# EAGLE design attiny (EAGLE 9.6.2)
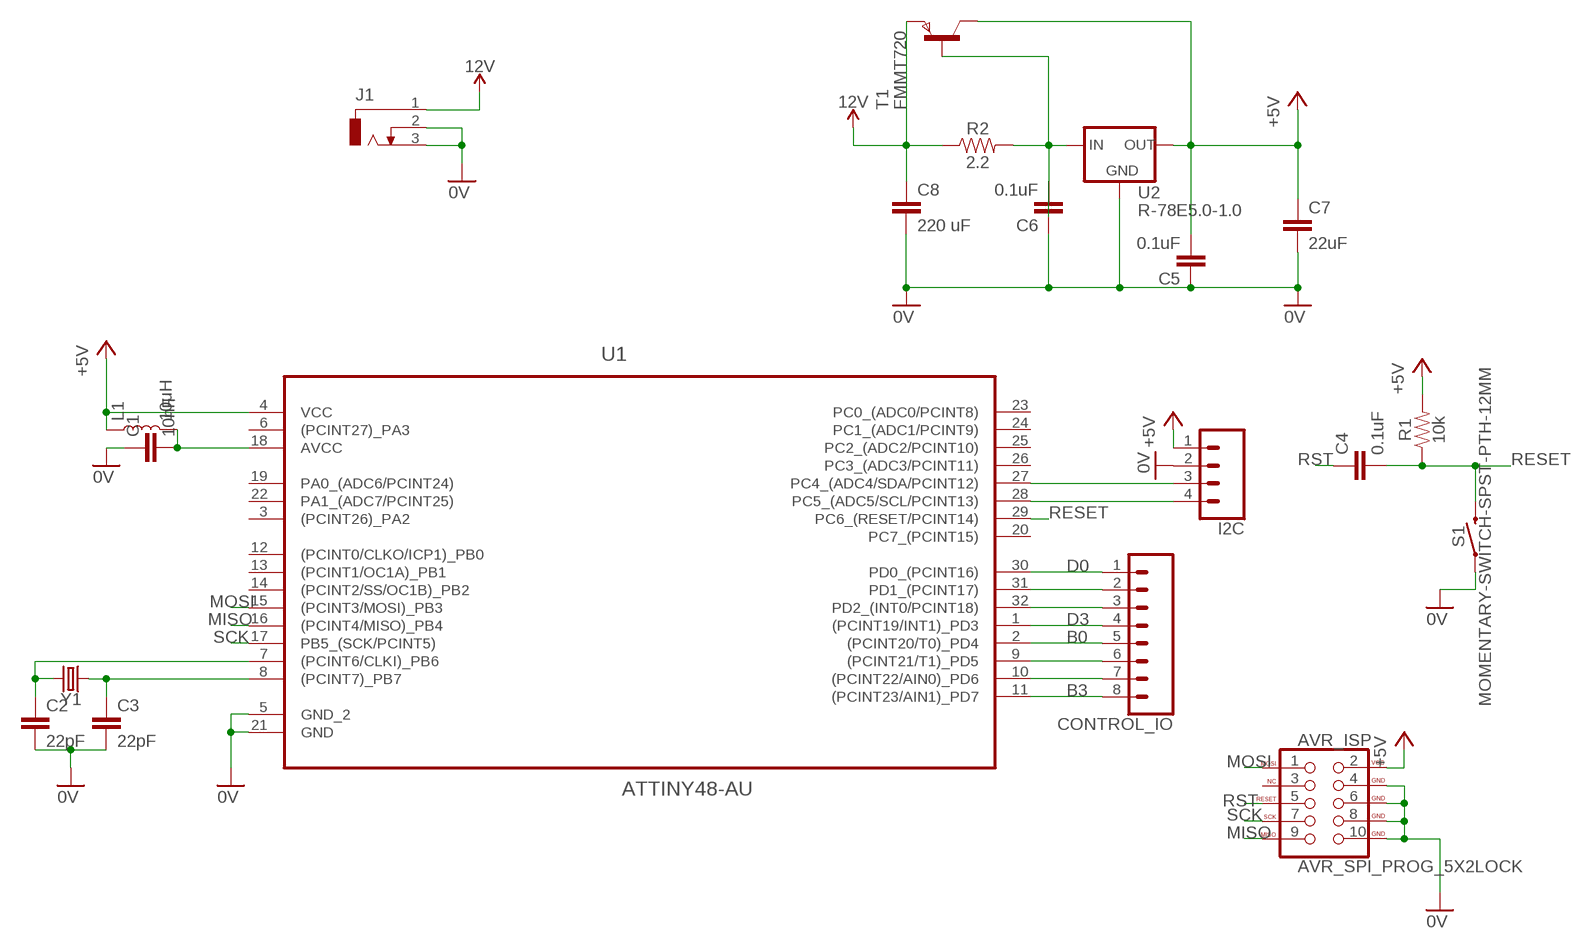
[diagram p0: schematic, sheet 1]

## Parts
AVR_ISP  AVR_SPI_PROG_5X2LOCK  [2X5-SHROUDED_LOCK]
C1  10nF  10NF-PTH-10MM-10000V-1-%  [CAP-PTH-10MM]
C2  22pF  22PF-0603-50V-5%  [0603]
C3  22pF  22PF-0603-50V-5%  [0603]
C4  0.1uF  0.1UF-KIT-EZ-50V-20%  [CAP-PTH-SMALL-KIT]
C5  0.1uF  0.1UF-KIT-EZ-50V-20%  [CAP-PTH-SMALL-KIT]
C6  0.1uF  0.1UF-KIT-EZ-50V-20%  [CAP-PTH-SMALL-KIT]
C7  22uF  22UF-0805-6.3V-20%  [0805]
C8  220 uF  C7.5/5  [C7.5B5]
CONTROL_IO  CONN_08"  [1X08]
I2C  CONN_04PTH  [1X04]
J1  DCJ0303  [DCJ0303]
L1  10μH  10μH_SHIELDED_INDUCTOR0805  [0805]
R1  10k  10KOHM-HORIZ-1/6W-5%  [AXIAL-0.3]
R2  2.2  2.2OHM-0603-1/10W-5%  [0603]
S1  MOMENTARY-SWITCH-SPST-PTH-12MM  [TACTILE_SWITCH_PTH_12MM]
T1  FMMT720  [SOT-23]
U1  ATTINY48-AU  [QFP80P900X900X120-32N]
U2  R-78E5.0-1.0  [DC-DC_CONVERTER_78XX]
Y1  CRYSTALPTH-2X6  [CRYSTAL-PTH-2X6-CYL]

## Nets
0V: AVR_ISP.4(GND) AVR_ISP.6(GND) AVR_ISP.8(GND) AVR_ISP.10(GND) C1.1 C2.2 C3.2 C5.1 C6.1 C7.2 C8.2 I2C.2 J1.2 J1.3 S1.1 U1.5(GND_2) U1.21(GND) U2.GND
12V: C8.1 J1.1 R2.1 T1.2(E)
+5V: AVR_ISP.2(VCC) C5.2 C7.1 I2C.1 L1.1 R1.P$2 T1.1(C) U1.4(VCC) U2.VOUT(OUT)
B0: CONTROL_IO.5 U1.2((PCINT20/T0)_PD4)
B3: CONTROL_IO.8 U1.11((PCINT23/AIN1)_PD7)
D0: CONTROL_IO.1 U1.30(PD0_(PCINT16))
D3: CONTROL_IO.4 U1.1((PCINT19/INT1)_PD3)
MISO: AVR_ISP.9(MISO) U1.16((PCINT4/MISO)_PB4)
MOSI: AVR_ISP.1(MOSI) U1.15((PCINT3/MOSI)_PB3)
N$1: C1.2 L1.2 U1.18(AVCC)
N$2: I2C.3 U1.27(PC4_(ADC4/SDA/PCINT12))
N$3: I2C.4 U1.28(PC5_(ADC5/SCL/PCINT13))
N$4: C2.1 U1.7((PCINT6/CLKI)_PB6) Y1.2
N$5: C3.1 U1.8((PCINT7)_PB7) Y1.1
N$6: C6.2 R2.2 T1.3(B) U2.VIN(IN)
N$7: CONTROL_IO.2 U1.31(PD1_(PCINT17))
N$8: CONTROL_IO.3 U1.32(PD2_(INT0/PCINT18))
N$11: CONTROL_IO.6 U1.9((PCINT21/T1)_PD5)
N$12: CONTROL_IO.7 U1.10((PCINT22/AIN0)_PD6)
RESET: C4.2 R1.P$1 S1.3 U1.29(PC6_(RESET/PCINT14))
RST: AVR_ISP.5(RESET) C4.1
SCK: AVR_ISP.7(SCK) U1.17(PB5_(SCK/PCINT5))
Unconnected: AVR_ISP.3(NC) U1.3((PCINT26)_PA2) U1.6((PCINT27)_PA3) U1.12((PCINT0/CLKO/ICP1)_PB0) U1.13((PCINT1/OC1A)_PB1) U1.14((PCINT2/SS/OC1B)_PB2) U1.19(PA0_(ADC6/PCINT24)) U1.20(PC7_(PCINT15)) U1.22(PA1_(ADC7/PCINT25)) U1.23(PC0_(ADC0/PCINT8)) U1.24(PC1_(ADC1/PCINT9)) U1.25(PC2_(ADC2/PCINT10)) U1.26(PC3_(ADC3/PCINT11))

## Library data of the parts
AVR_ISP = SparkFun-Connectors:AVR_SPI_PROG_5X2: AVR 10-pin ICSP Header This is the standard AVR In Circuit Serial Programming header. Minimal, but includes pin one indicator. Works with standard Olimex programmers. SparkFun Products: 2x5 AVR ICSP Male Header <https://www.sparkfun.com/products/778> - PTH 2x5 Pin Shrouded Header <https://www.sparkfun.com/products/8506> - PTH2; PROD_ID: CONN-08671; SF_ID: PRT-08506
C1 = SparkFun-Capacitors:10NF: 0.01uF/10nF/10,000pF ceramic capacitors A capacitor is a passive two-terminal electrical component used to store electrical energy temporarily in an electric field. CAP-09321; PROD_ID: CAP-09321
C2 C3 = SparkFun-Capacitors:22PF: 22pF ceramic capacitors A capacitor is a passive two-terminal electrical component used to store electrical energy temporarily in an electric field.; PROD_ID: CAP-07876
C4-C6 = SparkFun-Capacitors:0.1UF: 0.1µF ceramic capacitors A capacitor is a passive two-terminal electrical component used to store electrical energy temporarily in an electric field.; PROD_ID: CAP-08370
C7 = SparkFun-Capacitors:22UF: 22µF ceramic capacitors A capacitor is a passive two-terminal electrical component used to store electrical energy temporarily in an electric field.; PROD_ID: CAP-08402
C8 = capacitor-wima:C: CAPACITOR naming: grid - package width
CONTROL_IO = SparkFun-Connectors:CONN_08: Multi connection point. Often used as Generic Header-pin footprint for 0.1 inch spaced/style header connections On any of the 0.1 inch spaced packages, you can populate with these: Break Away Headers - Straight <https://www.sparkfun.com/products/116> (PRT-00116) Break Away Male Headers - Right Angle <https://www.sparkfun.com/products/553> (PRT-00553) Female Headers <https://www.sparkfun.com/products/115> (PRT-00115) Break Away Headers - Machine Pin <https://www.sparkfun.com/products/117> (PRT-00117) Break Away Female Headers - Swiss Machine Pin <https://www.sparkfun.com/products/743> (PRT-00743) Arduino Stackable Header - 8 Pin <https://www.sparkfun.com/products/9279> (PRT-09279) For SCREWTERMINALS and SPRING TERMINALS visit here: Screw Terimnals on SparkFun.com <https://www.sparkfun.com/search/results?term=Screw+Terminals> (5mm/3.5mm/2.54mm spacing) This device is also useful as a general connection point to wire up your design to another part of your project. Our various solder wires solder well into these plated through hole pads. Hook-Up Wire - Assortment (Stranded, 22 AWG) <https://www.sparkfun.com/products/11375> (PRT-11375) Hook-Up Wire - Assortment (Solid Core, 22 AWG) <https://www.sparkfun.com/products/11367> (PRT-11367) View the entire wire category on our website here <https://www.sparkfun.com/categories/141> Special notes: Molex polarized connector foot print use with SKU : PRT-08231 with associated crimp pins and housings. 1MM SMD Version SKU: PRT-10208 NOTES ON THE VARIANTS LOCK and LOCK_LONGPADS... This footprint was designed to help hold the alignment of a through-hole component (i.e. 6-pin header) while soldering it into place. You may notice that each hole has been shifted either up or down by 0.005 of an inch from it's more standard position (which is a perfectly straight line). This slight alteration caused the pins (the squares in the middle) to touch the edges of the holes. Because they are alternating, it causes a "brace" to hold the component in place. 0.005 has proven to be the perfect amount of "off-center" position when using our standard breakaway headers. Although looks a little odd when you look at the bare footprint, once you have a header in there, the alteration is very hard to notice. Also,if you push a header all the way into place, it is covered up entirely on the bottom side.; PROD_ID: CONN-08438
I2C = SparkFun-Connectors:CONN_04: Multi connection point. Often used as Generic Header-pin footprint for 0.1 inch spaced/style header connections On any of the 0.1 inch spaced packages, you can populate with these: Break Away Headers - Straight <https://www.sparkfun.com/products/116> (PRT-00116) Break Away Male Headers - Right Angle <https://www.sparkfun.com/products/553> (PRT-00553) Female Headers <https://www.sparkfun.com/products/115> (PRT-00115) Break Away Headers - Machine Pin <https://www.sparkfun.com/products/117> (PRT-00117) Break Away Female Headers - Swiss Machine Pin <https://www.sparkfun.com/products/743> (PRT-00743) For SCREWTERMINALS and SPRING TERMINALS visit here: Screw Terimnals on SparkFun.com <https://www.sparkfun.com/search/results?term=Screw+Terminals> (5mm/3.5mm/2.54mm spacing) This device is also useful as a general connection point to wire up your design to another part of your project. Our various solder wires solder well into these plated through hole pads. Hook-Up Wire - Assortment (Stranded, 22 AWG) <https://www.sparkfun.com/products/11375> (PRT-11375) Hook-Up Wire - Assortment (Solid Core, 22 AWG) <https://www.sparkfun.com/products/11367> (PRT-11367) View the entire wire category on our website here <https://www.sparkfun.com/categories/141> Special notes: Molex polarized connector foot print use with SKU : PRT-08231 with associated crimp pins and housings. 1MM SMD Version SKU: PRT-10208; PROD_ID: CONN-09696
J1 = con-jack:DCJ0303: DC POWER JACK Source: DCJ0303.pdf; OC_FARNELL: unknown; OC_NEWARK: unknown
L1 = SparkFun-Coils:10μH_SHIELDED_INDUCTOR: Murata 10uH Inductor 10uH 60mA 400mOhm 0805 Package Shielded; PROD_ID: NDUC-13231
R1 = SparkFun-Resistors:10KOHM: 10kΩ resistor A resistor is a passive two-terminal electrical component that implements electrical resistance as a circuit element. Resistors act to reduce current flow, and, at the same time, act to lower voltage levels within circuits. - Wikipedia; PROD_ID: RES-08375
R2 = SparkFun-Resistors:2.2OHM: 2.2Ω resistor A resistor is a passive two-terminal electrical component that implements electrical resistance as a circuit element. Resistors act to reduce current flow, and, at the same time, act to lower voltage levels within circuits. - Wikipedia; PROD_ID: RES-07823
S1 = SparkFun-Switches:MOMENTARY-SWITCH-SPST: Momentary Switch (Pushbutton) - SPST Normally-open (NO) SPST momentary switches (buttons, pushbuttons). Variants PTH-12MM - 12mm square, through-hole Momentary Pushbutton Switch - 12mm Square <https://www.sparkfun.com/products/9190> (COM-09190) PTH-6.0MM, PTH-6.0MM-KIT - 6.0mm square, through-hole Mini Pushbutton Switch <https://www.sparkfun.com/products/97> (COM-00097) KIT package intended for soldering kit's - only one side of pads' copper is exposed. PTH-RIGHT-ANGLE-KIT - Right-angle, through-hole Right Angle Tactile Button <https://www.sparkfun.com/products/10791> - Used on SparkFun BigTime Watch Kit <https://www.sparkfun.com/products/11734> SMD-12MM - 12mm square, surface-mount Tactile Button - SMD (12mm) <https://www.sparkfun.com/products/12993> (COM-12993) Used on SparkFun PicoBoard <https://www.sparkfun.com/products/11888> SMD-4.5MM - 4.5mm Square Trackball Switch Used on SparkFun Blackberry Trackballer Breakout <https://www.sparkfun.com/products/13169> SMD-4.6MMX2.8MM - 4.60mm x 2.80mm, surface mount Used on SparkFun Pro Micro - RP2040 <https://www.sparkfun.com/products/17717> SMD-5.2MM, SMD-5.2-REDUNDANT - 5.2mm square, surface-mount Mini Pushbutton Switch - SMD <https://www.sparkfun.com/products/8720> (COM-08720) Used on Arduino Pro Mini <https://www.sparkfun.com/products/11114> REDUNDANT package connects both switch circuits together SMD-6.0X3.5MM - 6.0 x 3.5mm, surface mount Momentary Reset Switch SMD <https://www.sparkfun.com/products/8229> (COM-08229) SMD-6.2MM-TALL - 6.2mm square, surface mount Tactile Button - SMD (6mm) <https://www.sparkfun.com/products/12992> Used on SparkFun Digital Sandbox <https://www.sparkfun.com/products/12651> SMD-RIGHT-ANGLE - Right-angle, surface mount Used on SparkFun Block for Intel® Edison - Arduino <https://www.sparkfun.com/products/13036>; PROD_ID: SWCH-09185; SF_SKU: COM-09190
T1 = zetex:FMMT7*: PNP SILICON POWER (SWITCHING) TRANSISTORS SuperSOT Source: http://www.zetex.com/3.0/pdf/FMMT717.pdf; MPN: FMMT720; OC_FARNELL: 9526471; OC_NEWARK: 96K9969
U1 = ATTINY48-AU:ATTINY48-AU: 8-bit Microcontroller Check prices <https://pricing.snapeda.com/parts/ATTINY48-AU/Microchip/view-part?ref=eda>; AVAILABILITY: In Stock; DESCRIPTION: Clock speed: 12 MHz; Connectivity: I²C, SPI; Core size: 8-Bit; Data converter (embedded microcontroller): A/D 8x10b; EEPROM size (embedded microcontroller): 64 x 8; Enclosure type (semiconductors): TQFP 32 (7x7); I/O number: 28; Manufacturer: Microchip Technology; Manufacturer code (components): MCP; Operating temperature (max.) (num): +85 °C; Operating temperature (min.) (num): -40 °C; Oscillator type (embedded microcontroller): Internal; Peripherals: Brown-out Detect/Reset, POR, WDT; Processor core: AVR; Program memory size (embedded microcontroller): 4 KB (2 K x 16); Program memory type (embedded microcontroller): FLASH; RAM size (microcontroller): 256 x 8; Series (embedded microcontrollers): AVR® ATtiny; Supply voltage (max.): 5.5 V; Supply voltage (min.): 1.8 V; Type (manufacturer type): ATTINY48-AU; Type of embedded system (category): Embedded microcontroller; MF: Microchip; MP: ATTINY48-AU; PACKAGE: TQFP-32 Microchip; PRICE: None; PURCHASE-URL: https://pricing.snapeda.com/search/part/ATTINY48-AU/?ref=eda
U2 = SparkFun-IC-Power:R-78E5.0-1.0: Recom Power 5V 1A DC/DC Converter The Recom R-78E5.0-X.X is a compact DC/DC converter module that is a pin for pin drop-in replacement for the LM7805 linear voltage regulator. Specifications: Input Range: 7-28V Output Voltage: 5V Output Current: 1A Max Efficiency: 91% Datasheet <https://www.recom-power.com/pdf/Innoline/R-78Exx-1.0.pdf>; PROD_ID: COM-13655
Y1 = SparkFun-Clocks:CRYSTAL: Crystals (Generic) These are passive quartz crystals, which can be used as a clock source for a microcontroller. Crystal's are two-terminal devices. They require external "load" capacitors to generate an oscillating signal.

## Board
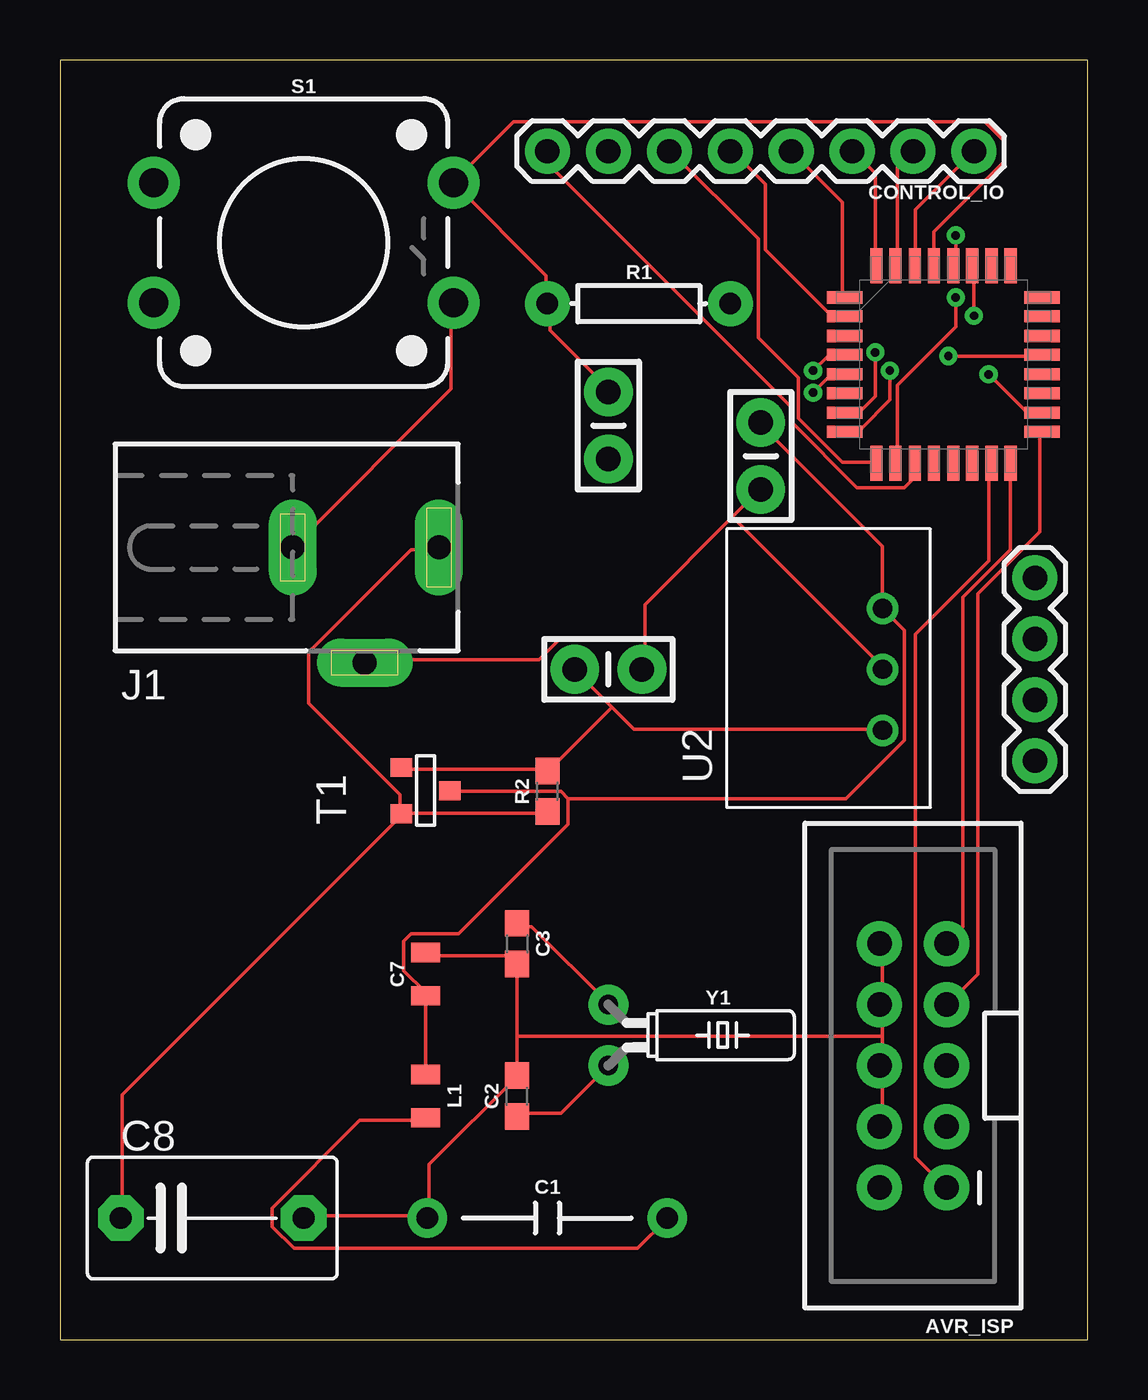
[diagram p1: board, top side]
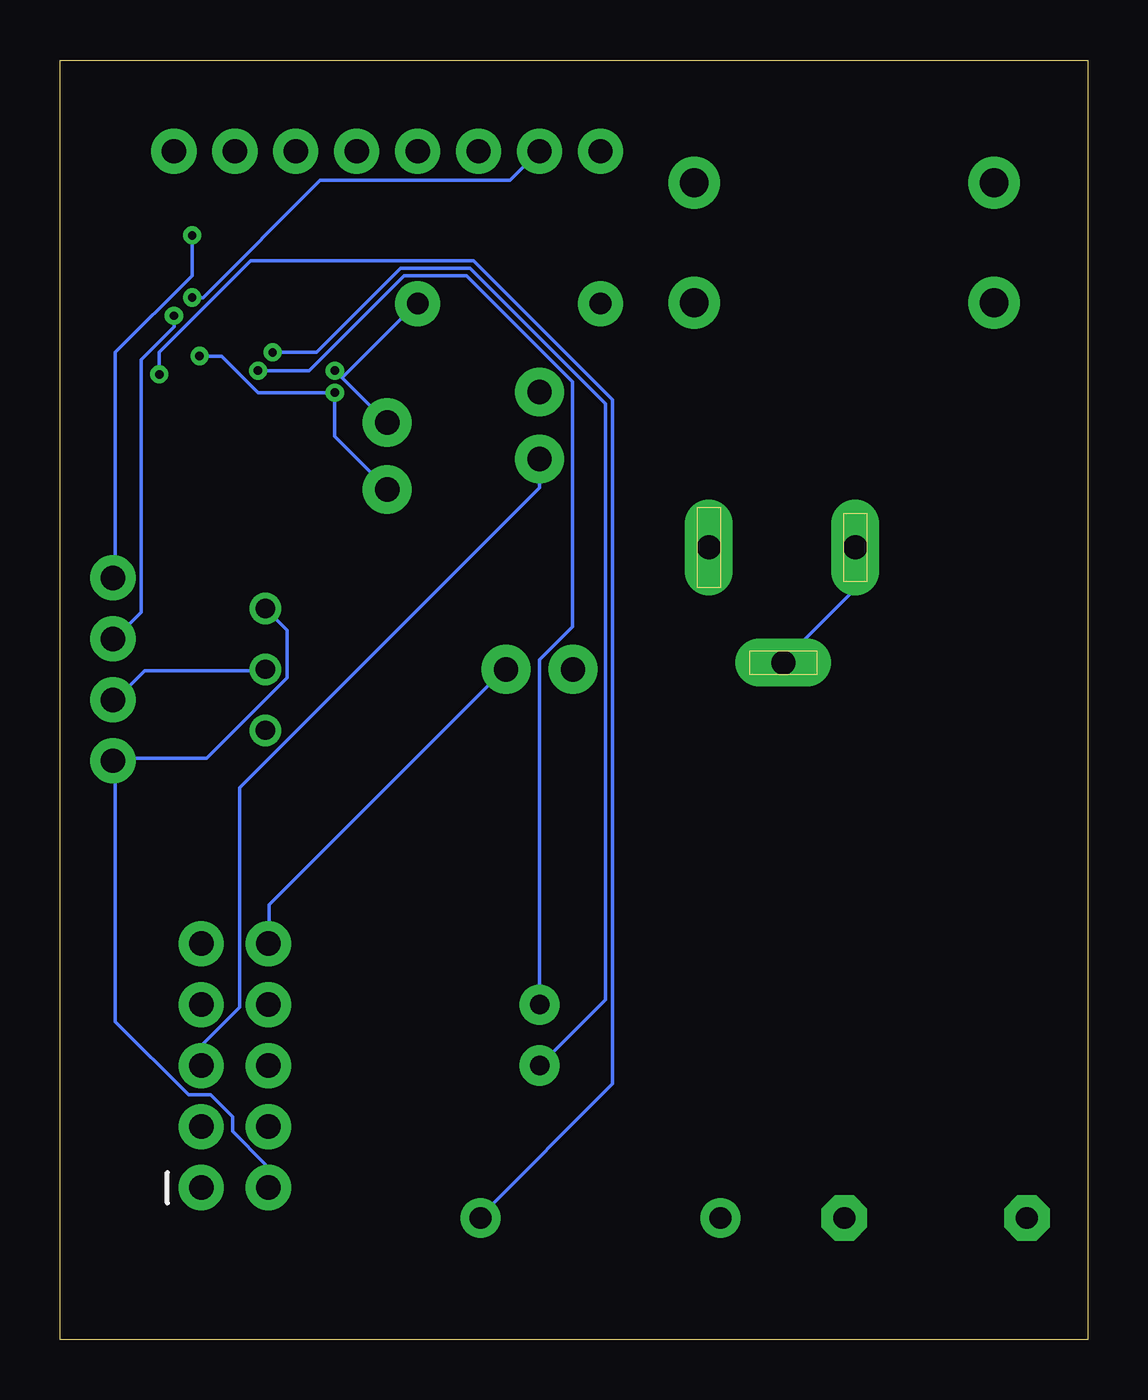
[diagram p2: board, bottom side, seen from below]

Size 42.85 x 53.33 mm. Coordinates in mm from the lower left corner, seen from the top.
Outline: 0,0 42.85,0 42.85,53.33 0,53.33 0,0
Copper layers (1*16): Top 0.035mm / dielectric 1.5mm / Bottom 0.035mm
Design rules "default": minimum track width 6mil, minimum drill 0.35mm, track to track 6mil, track to pad 6mil, pad to pad 6mil, via to via 6mil, smd to smd 6mil, copper to edge 40mil, drill to drill 6mil, minimum pad ring 10mil, minimum via ring 8mil, stop-mask expansion 4mil, vias tented up to drill 0mil, thermal gap 10mil

### Footprints (pad centres in the part's own frame; a part is rotated, then mirrored left to right if it is on the bottom)
2X5-SHROUDED_LOCK = drill 1.016 pad 1.88: 1 -1.397,5.08; 2 1.397,5.08; 3 -1.397,2.54; 4 1.397,2.54; 5 -1.397,0; 6 1.397,0; 7 -1.397,-2.54; 8 1.397,-2.54; 9 -1.397,-5.08; 10 1.397,-5.08
CAP-PTH-10MM = drill 0.9 pad 1.651: 1 -5,0; 2 5,0
0603 = smd 1.1 x 1: 1 -0.85,0; 2 0.85,0
CAP-PTH-SMALL-KIT = drill 1.016 pad 2.032: 1 -1.397,0; 2 1.397,0
0805 = smd 0.8 x 1.2: 1 -0.9,0; 2 0.9,0
C7.5B5 = drill 0.914 pad 1.905 octagon: 1 -3.81,0; 2 3.81,0
1X08 = drill 1.016 pad 1.88: 1 0,0; 2 2.54,0; 3 5.08,0; 4 7.62,0; 5 10.16,0; 6 12.7,0; 7 15.24,0; 8 17.78,0
1X04 = drill 1.016 pad 1.88: 1 0,0; 2 2.54,0; 3 5.08,0; 4 7.62,0
DCJ0303 = drill 1 pad 2 long: 1 0,3.1; 2 4.8,0; 3 0,-3
AXIAL-0.3 = drill 0.9 pad 1.88: P$1 -3.81,0; P$2 3.81,0
TACTILE_SWITCH_PTH_12MM = drill 1.2 pad 2.159: 1 6.25,-2.5; 2 -6.25,-2.5; 3 6.25,2.5; 4 -6.25,2.5
SOT-23 = smd 0.787 x 0.889: 1 0.025,-1.016; 2 -0.94,1.016; 3 0.991,1.016
QFP80P900X900X120-32N = smd 1.473 x 0.508: 1 -4.115,2.794; 2 -4.115,2.007; 3 -4.115,1.194; 4 -4.115,0.406; 5 -4.115,-0.406; 6 -4.115,-1.194; 7 -4.115,-2.007; 8 -4.115,-2.794; 17 4.115,-2.794; 18 4.115,-2.007; 19 4.115,-1.194; 20 4.115,-0.406; 21 4.115,0.406; 22 4.115,1.194; 23 4.115,2.007; 24 4.115,2.794 | smd 0.508 x 1.473: 9 -2.794,-4.115; 10 -2.007,-4.115; 11 -1.194,-4.115; 12 -0.406,-4.115; 13 0.406,-4.115; 14 1.194,-4.115; 15 2.007,-4.115; 16 2.794,-4.115; 25 2.794,4.115; 26 2.007,4.115; 27 1.194,4.115; 28 0.406,4.115; 29 -0.406,4.115; 30 -1.194,4.115; 31 -2.007,4.115; 32 -2.794,4.115
DC-DC_CONVERTER_78XX = drill 0.8: GND 0,0; VIN -2.54,0; VOUT 2.54,0
CRYSTAL-PTH-2X6-CYL = drill 0.813 pad 1.676: 1 -1.27,0; 2 1.27,0

### Placement (x,y rotation side)
AVR_ISP  35.56,11.43 180 top
C1  20.32,5.08 0 top
C2  19.05,10.16 90 top
C3  19.05,16.51 270 top
C4  22.86,38.1 90 top
C5  29.21,36.83 90 top
C6  22.86,27.94 180 top
C7  15.24,15.24 90 top
C8  6.35,5.08 0 top
CONTROL_IO  38.1,49.53 180 top
I2C  40.64,24.13 90 top
J1  12.7,33.02 270 top
L1  15.24,10.16 270 top
R1  24.13,43.18 0 top
R2  20.32,22.86 90 top
S1  10.16,45.72 0 top
T1  15.24,22.86 90 top
U1  36.83,40.64 0 top
U2  34.29,27.94 90 top
Y1  22.86,12.7 270 top

### Tracks (layer width: path | path; a pad name or v marks a point on that pad's centre or on a via)
0V  (via drill 0.35)
  Top 0.152: 34.29,11.43 34.29,8.99 AVR_ISP.4 | AVR_ISP.10 34.29,16.46 34.29,14.02 AVR_ISP.8 34.29,13.87 34.29,12.65 | 34.29,12.65 34.29,11.43 | 34.29,11.43 AVR_ISP.6 | 19.05,12.65 C3.2 19.05,15.7 18.75,16 15.24,16 C7.2 | 19.05,12.65 C2.2 19.05,10.97 15.39,7.32 15.39,5.18 C1.1 15.24,5.18 10.21,5.18 C8.2 | 19.05,12.65 34.29,12.65 | S1.1 16.31,43.13 16.31,39.62 9.75,33.07 J1.3 | U1.5 32.16,40.23 v31.39,39.47 | v37.03,41 40.84,41 U1.21 | 24.38,29.26 24.38,30.63 28.04,34.29 | 24.38,29.26 24.38,28.04 C6.1 | 28.04,34.29 29.11,35.36 C5.1 | 28.04,34.29 34.29,28.04 U2.GND | 24.38,29.26 20.88,29.26 19.96,28.35 12.8,28.35 J1.2
  Bottom 0.152: J1.3 9.75,32.92 9.75,31.24 12.65,28.35 J1.2 | U2.GND 34.29,27.89 39.32,27.89 40.54,26.67 I2C.2 | C5.1 29.26,35.51 31.39,37.64 v31.39,39.47 34.59,39.47 36.12,41 v37.03,41 | AVR_ISP.10 34.14,16.61 34.14,18.14 24.38,27.89 C6.1
12V
  Top 0.152: T1.2 14.33,21.95 20.27,21.95 R2.1 | T1.2 14.17,21.95 14.17,22.71 10.36,26.52 10.36,28.65 14.63,32.92 15.7,32.92 J1.1 | C8.1 2.59,5.18 2.59,10.21 14.17,21.79 T1.2
+5V  (via drill 0.35)
  Top 0.152: 21.18,22.55 20.88,22.86 16.31,22.86 T1.1 | 21.18,22.55 21.18,21.49 16.61,16.92 14.63,16.92 14.33,16.61 14.33,15.39 15.24,14.48 C7.1 L1.1 | v31.39,40.39 32,41 32.61,41 U1.4 | C5.2 29.26,38.1 34.29,33.07 U2.VOUT 35.2,29.57 35.2,24.99 32.77,22.55 21.18,22.55
  Bottom 0.152: AVR_ISP.2 34.29,6.4 34.29,7.32 35.66,8.69 35.66,9.3 36.58,10.21 37.49,10.21 40.54,13.26 40.54,24.08 I2C.1 40.54,24.23 36.73,24.23 33.38,27.58 33.38,29.57 U2.VOUT | 31.09,40.08 29.26,38.25 C5.2 | 31.09,40.08 v31.39,40.39 | 31.09,40.08 28.04,43.13 R1.P$2
B0
  Top 0.152: U1.2 32.61,42.67 32.16,42.67 29.41,45.41 29.41,48.16 28.04,49.53 CONTROL_IO.5
B3
  Top 0.152: U1.11 35.51,36.42 35.51,35.81 35.2,35.51 33.22,35.51 30.48,38.25 30.48,38.86 20.42,48.92 20.42,49.53 CONTROL_IO.8
D0
  Top 0.152: CONTROL_IO.1 35.66,47.09 35.66,44.81 U1.30
D3
  Top 0.152: CONTROL_IO.4 32.61,47.4 32.61,43.43 U1.1
MISO
  Top 0.152: U1.16 39.62,32.92 37.64,30.94 37.64,17.22 37.03,16.61 AVR_ISP.9
MOSI
  Top 0.152: U1.15 38.71,36.42 38.71,32.46 35.66,29.41 35.66,7.62 36.88,6.4 AVR_ISP.1
N$1  (via drill 0.35)
  Top 0.152: L1.2 15.24,9.14 12.5,9.14 8.84,5.49 8.84,4.72 9.75,3.81 24.08,3.81 25.3,5.03 C1.2 | v38.71,40.23 40.23,38.71 40.84,38.71 U1.18
  Bottom 0.152: v38.71,40.23 38.71,41.15 34.9,44.96 25.6,44.96 19.81,39.17 19.81,10.67 25.3,5.18 C1.2
N$2  (via drill 0.35)
  Top 0.152: v38.1,42.67 38.1,44.65 U1.27
  Bottom 0.152: v38.1,42.67 38.1,42.22 39.47,40.84 39.47,30.33 40.54,29.26 I2C.3
N$3  (via drill 0.35)
  Top 0.152: v37.34,46.02 37.34,44.81 U1.28
  Bottom 0.152: v37.34,46.02 37.34,44.35 40.54,41.15 40.54,31.85 I2C.4
N$4  (via drill 0.35)
  Top 0.152: Y1.2 20.88,9.45 19.05,9.45 C2.1 | v33.98,41.15 33.98,39.32 33.38,38.71 32.77,38.71 U1.7
  Bottom 0.152: v33.98,41.15 32.16,41.15 28.65,44.65 25.76,44.65 20.12,39.01 20.12,14.17 Y1.2
N$5  (via drill 0.35)
  Top 0.152: C3.1 19.05,17.22 19.66,17.22 22.86,14.02 Y1.1 | v34.59,40.39 34.59,39.17 33.38,37.95 32.77,37.95 U1.8
  Bottom 0.152: v34.59,40.39 32.46,40.39 28.5,44.35 25.91,44.35 21.49,39.93 21.49,29.72 22.86,28.35 Y1.1
N$6
  Top 0.152: T1.3 14.33,23.77 20.27,23.77 R2.2 20.42,23.77 23.01,26.36 | 23.01,26.36 21.49,27.89 C6.2 | 23.01,26.36 23.93,25.45 34.29,25.45 U2.VIN
N$7
  Top 0.152: U1.31 34.9,44.81 34.9,48.92 35.51,49.53 CONTROL_IO.2
N$8
  Top 0.152: U1.32 33.98,44.81 33.98,48.62 33.07,49.53 CONTROL_IO.3
N$11
  Top 0.152: U1.9 33.98,36.58 32.61,36.58 30.79,38.41 30.79,40.08 29.11,41.76 29.11,45.87 25.45,49.53 CONTROL_IO.6
N$12  (via drill 0.35)
  Top 0.152: v37.34,43.43 37.34,42.22 34.9,39.78 34.9,36.58 U1.10
  Bottom 0.152: v37.34,43.43 36.88,43.43 32,48.31 24.08,48.31 CONTROL_IO.7
RESET
  Top 0.152: C4.2 22.86,39.62 20.42,42.06 20.42,43.13 R1.P$1 20.27,43.28 20.27,44.35 16.46,48.16 S1.3 16.46,48.31 18.9,50.75 38.56,50.75 39.32,49.99 39.32,49.07 36.42,46.18 U1.29
RST
  Bottom 0.152: C4.1 22.86,35.51 35.36,23.01 35.36,13.87 36.88,12.34 36.88,11.43 AVR_ISP.5
SCK
  Top 0.152: U1.17 40.84,37.8 40.84,33.68 38.25,31.09 38.25,15.24 37.03,14.02 AVR_ISP.7